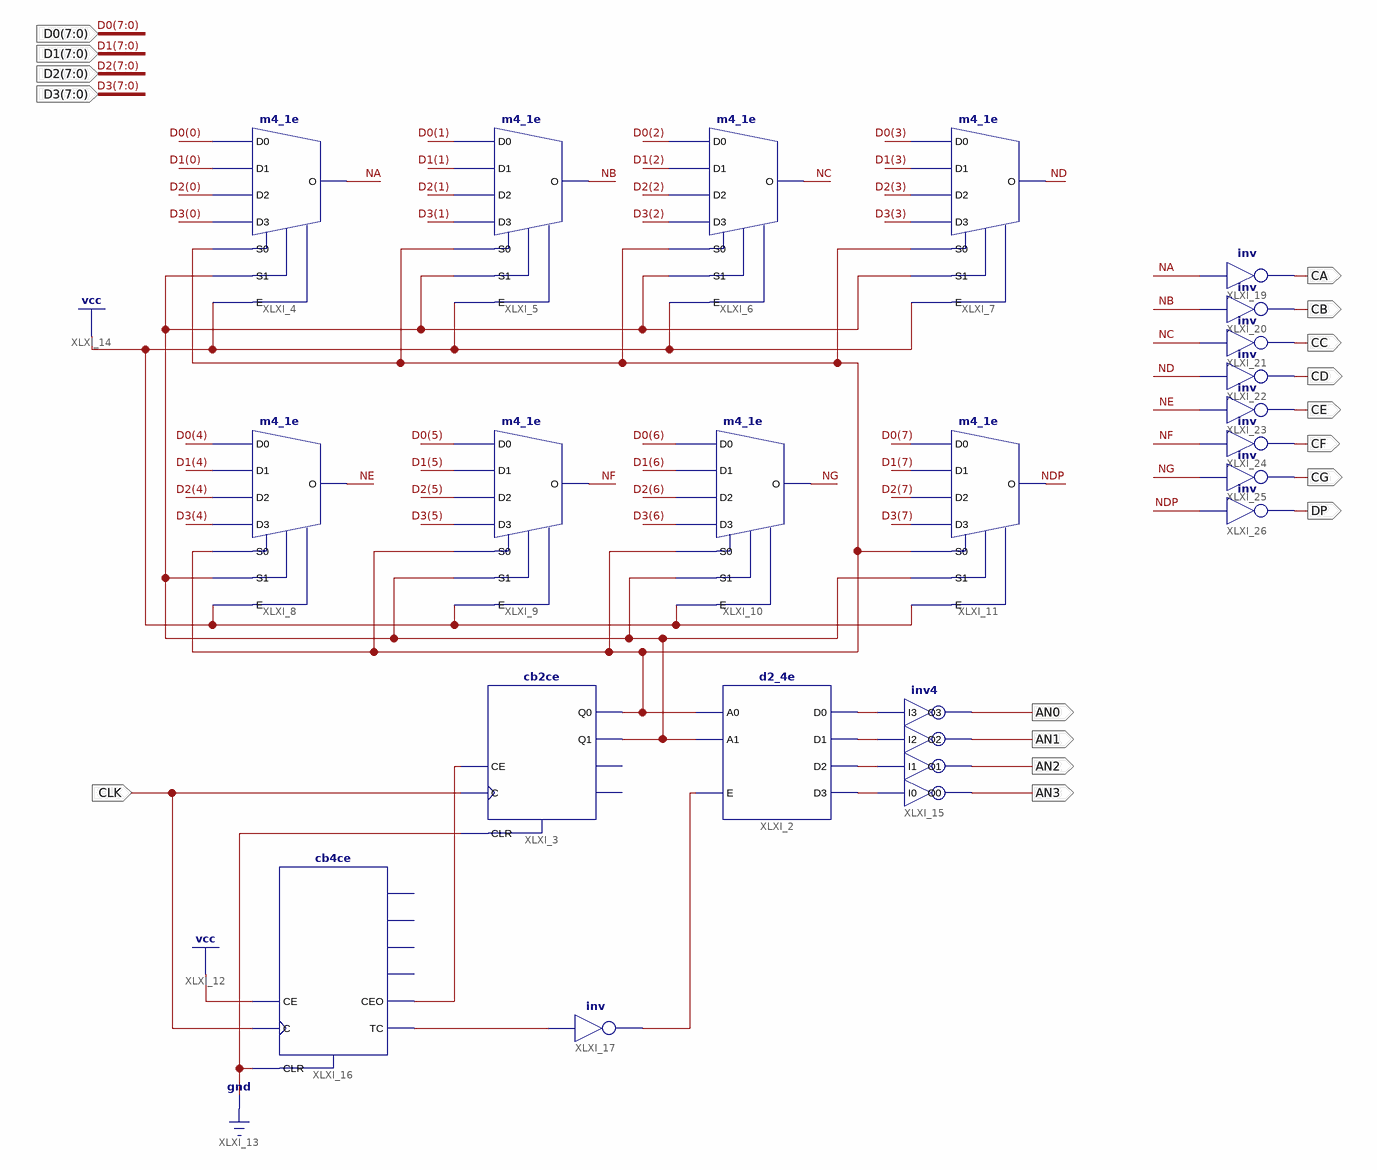
[diagram p0: schematic sheet 1]
// Xilinx ISE schematic display.sch (spartan3e) as structural Verilog: 21 symbols, 17 ports
module display (
  input  CLK,
  input  [7:0] D0,
  input  [7:0] D1,
  input  [7:0] D2,
  input  [7:0] D3,
  output AN0,
  output AN1,
  output AN2,
  output AN3,
  output CA,
  output CB,
  output CC,
  output CD,
  output CE,
  output CF,
  output CG,
  output DP
);

  wire NA, NB, NC, ND, NDP, NE, NF, NG, XLXN_18, XLXN_23, XLXN_24, XLXN_25, XLXN_26, XLXN_27, XLXN_35,
       XLXN_37, XLXN_38;

  d2_4e XLXI_2 (.A0(XLXN_18), .A1(XLXN_23), .E(XLXN_38), .D0(XLXN_24), .D1(XLXN_25), .D2(XLXN_26), .D3(XLXN_27));
  cb2ce XLXI_3 (.C(CLK), .CE(XLXN_35), .CLR(1'b0), .Q0(XLXN_18), .Q1(XLXN_23));  // open: CEO, TC
  m4_1e XLXI_4 (.D0(D0[0]), .D1(D1[0]), .D2(D2[0]), .D3(D3[0]), .E(1'b1), .S0(XLXN_18), .S1(XLXN_23), .O(NA));
  m4_1e XLXI_5 (.D0(D0[1]), .D1(D1[1]), .D2(D2[1]), .D3(D3[1]), .E(1'b1), .S0(XLXN_18), .S1(XLXN_23), .O(NB));
  m4_1e XLXI_6 (.D0(D0[2]), .D1(D1[2]), .D2(D2[2]), .D3(D3[2]), .E(1'b1), .S0(XLXN_18), .S1(XLXN_23), .O(NC));
  m4_1e XLXI_7 (.D0(D0[3]), .D1(D1[3]), .D2(D2[3]), .D3(D3[3]), .E(1'b1), .S0(XLXN_18), .S1(XLXN_23), .O(ND));
  m4_1e XLXI_8 (.D0(D0[4]), .D1(D1[4]), .D2(D2[4]), .D3(D3[4]), .E(1'b1), .S0(XLXN_18), .S1(XLXN_23), .O(NE));
  m4_1e XLXI_9 (.D0(D0[5]), .D1(D1[5]), .D2(D2[5]), .D3(D3[5]), .E(1'b1), .S0(XLXN_18), .S1(XLXN_23), .O(NF));
  m4_1e XLXI_10 (.D0(D0[6]), .D1(D1[6]), .D2(D2[6]), .D3(D3[6]), .E(1'b1), .S0(XLXN_18), .S1(XLXN_23), .O(NG));
  m4_1e XLXI_11 (.D0(D0[7]), .D1(D1[7]), .D2(D2[7]), .D3(D3[7]), .E(1'b1), .S0(XLXN_18), .S1(XLXN_23), .O(NDP));
  inv4 XLXI_15 (.I0(XLXN_27), .I1(XLXN_26), .I2(XLXN_25), .I3(XLXN_24), .O0(AN3), .O1(AN2), .O2(AN1), .O3(AN0));
  cb4ce XLXI_16 (.C(CLK), .CE(1'b1), .CLR(1'b0), .CEO(XLXN_35), .TC(XLXN_37));  // open: Q0, Q1, Q2, Q3
  not XLXI_17 (XLXN_38, XLXN_37);
  not XLXI_19 (CA, NA);
  not XLXI_20 (CB, NB);
  not XLXI_21 (CC, NC);
  not XLXI_22 (CD, ND);
  not XLXI_23 (CE, NE);
  not XLXI_24 (CF, NF);
  not XLXI_25 (CG, NG);
  not XLXI_26 (DP, NDP);
endmodule
